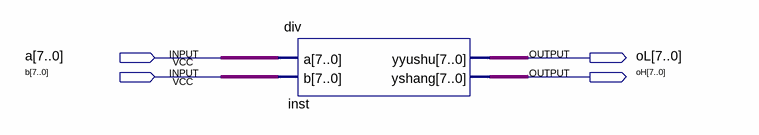
[diagram p0: schematic sheet]
// Quartus schematic tt8.bdf as structural Verilog: 1 symbols, 4 pins
module tt8 (
  input  [7:0] a,
  input  [7:0] b,
  output [7:0] oL,
  output [7:0] oH
);

  div inst (.a(a), .b(b), .yyushu(oL), .yshang(oH));
endmodule
